# Altium schematic sheet PSU_NCP630SET_1V2.SchDoc: PSU NCP630A SET TO 1V2
size A4; Organization: Altium Limited.; Address1: Level 3, 12a Rodborough Rd; Address2: Frenchs Forest 2086; Address3: NSW; Address4: AUSTRALIA; DocumentNumber: 38; SheetNumber: 67; SheetTotal: 106
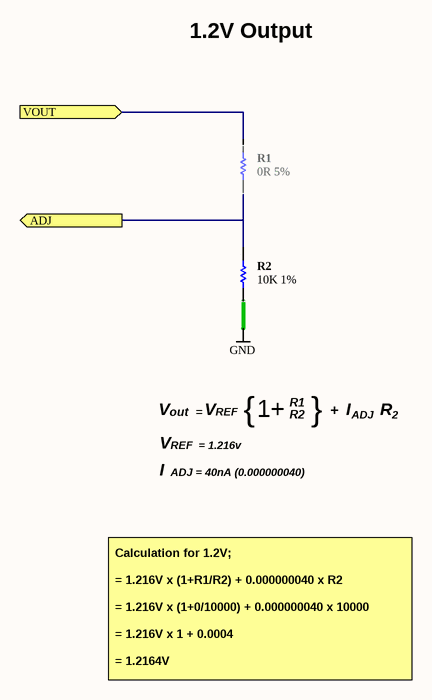
[diagram p0: PSU_NCP630SET_1V2.SchDoc]

## Parts
R1  0R 5%  [RESC1005-STAR]
R2  10K 1%  [RESC1005-STAR]

## Ports
ADJ (out), VOUT (in)

## Nets
GND: R2.2
ADJ: R1.1 R2.1 ; port ADJ
VOUT: R1.2 ; port VOUT

## Notes on the sheet
- 1.2V Output
- V
- out  =
- REF  = 1.216v
- REF
- {
- 1+
- R1
- R2
- }
- +
- I
- ADJ
- R
- 2
- ADJ = 40nA (0.000000040)
- Calculation for 1.2V;
  = 1.216V x (1+R1/R2) + 0.000000040 x R2
  = 1.216V x (1+0/10000) + 0.000000040 x 10000
  = 1.216V x 1 + 0.0004
  = 1.2164V
- Sheet Title
- Project Title
- Size:
- Date:
- A4
- Assy:
- Time:
- Revision:
- Sheet
- of
- File:

## Library data of the parts
R1 = D-100-0137: Resistor, 0R 5% 0402 (1005); Power Rating: 63mW; Category: Resistor; Mounting Technology: Surface Mount; Resistance: 0R; Status: Unreleased; Tolerance: 5%
R2 = D-100-0130: Resistor, 10K 1% 0402 (1005); Power Rating: 63 mW; Mounting Technology: Surface Mount; Resistance: 10 K; Status: Production; Tolerance: 1 %; Category: Resistor